# EAGLE board PIRT1280A1-12-carrier (EAGLE 9.6.2)
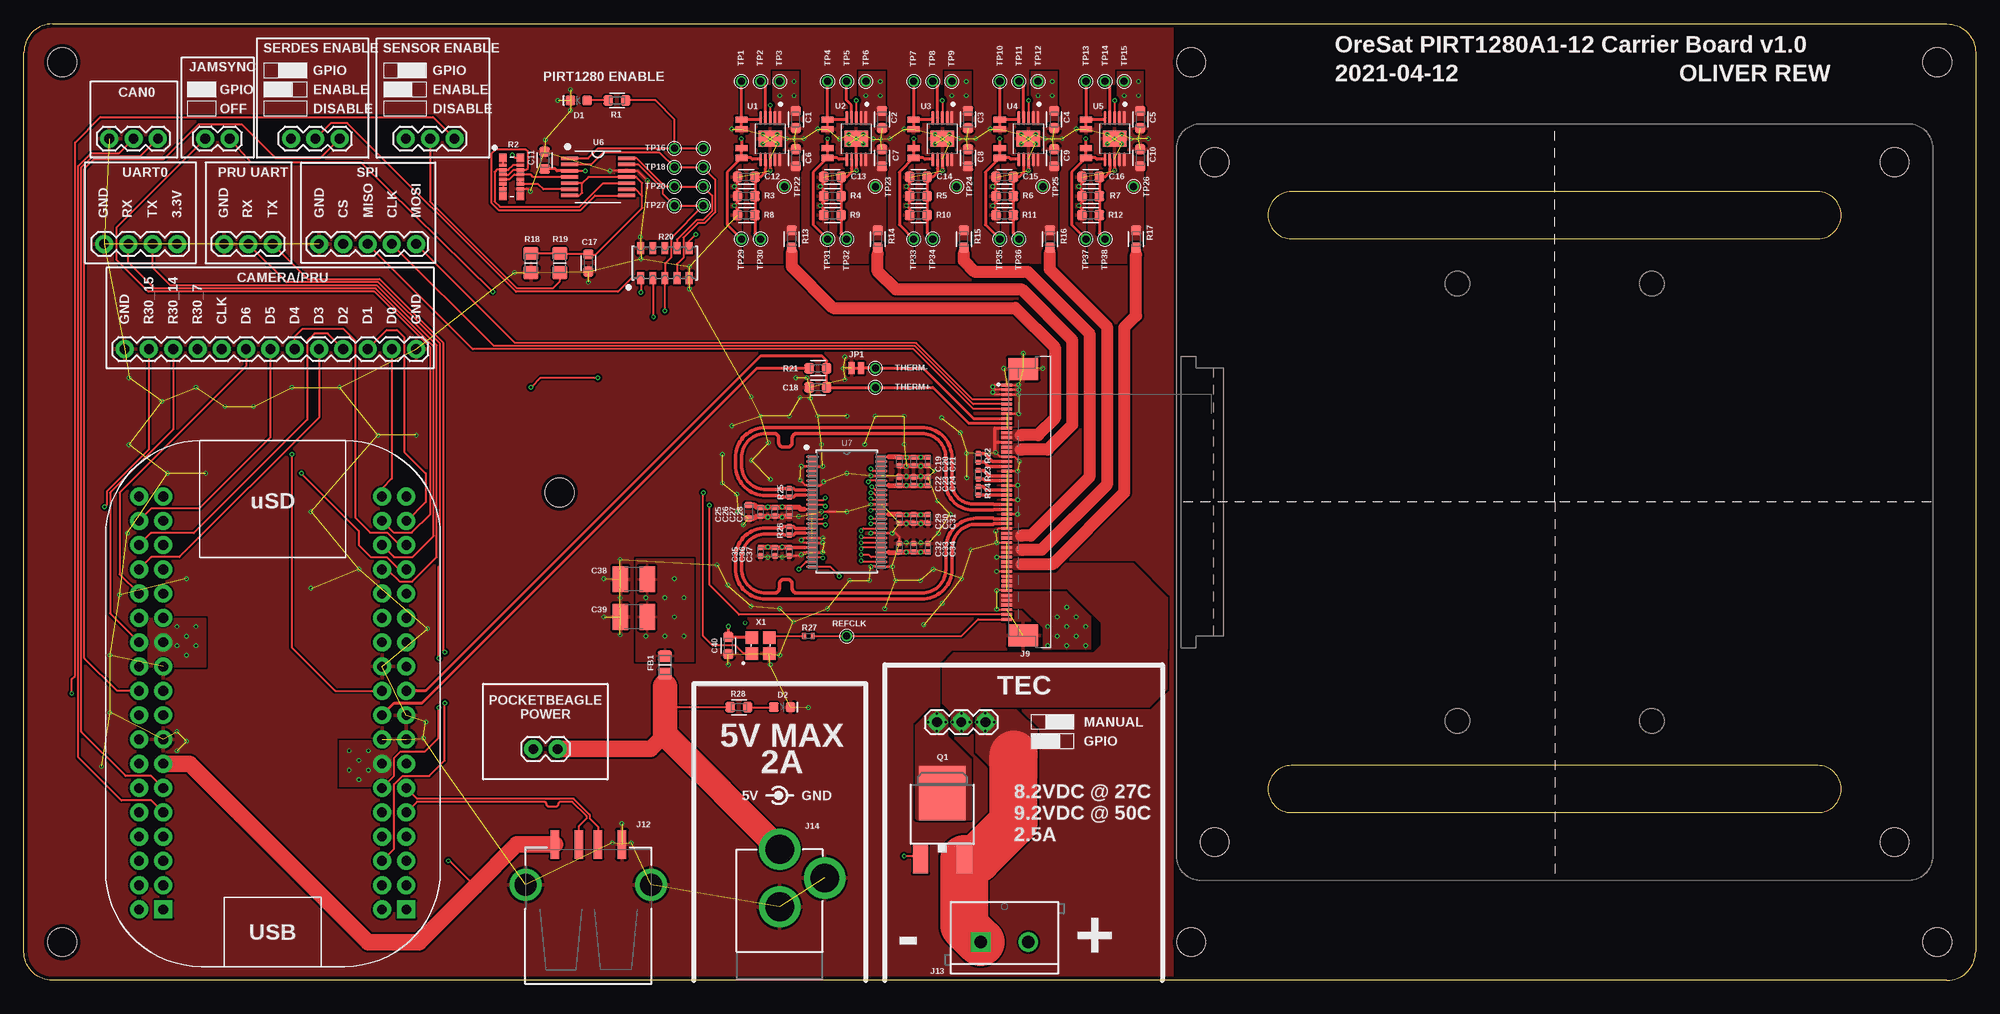
[diagram p7: board, top side]
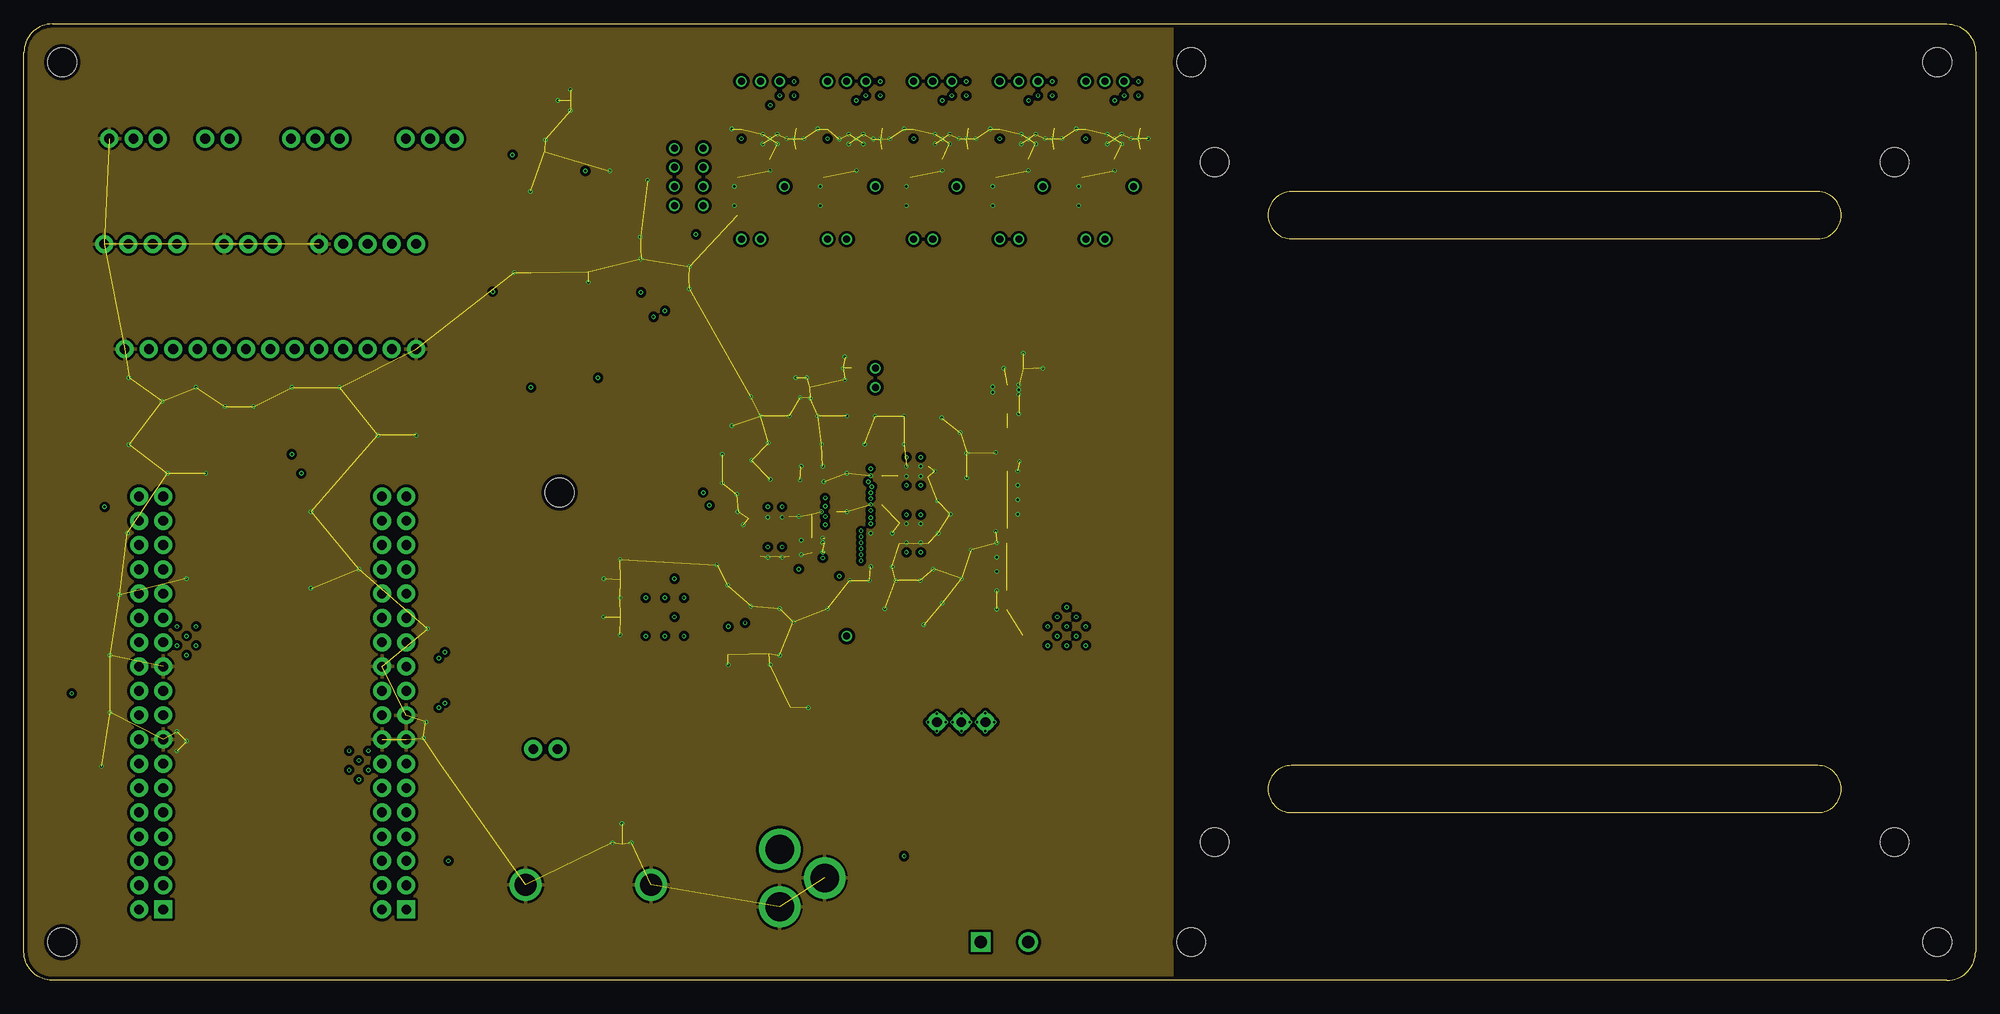
[diagram p8: board, inner layer Route2]
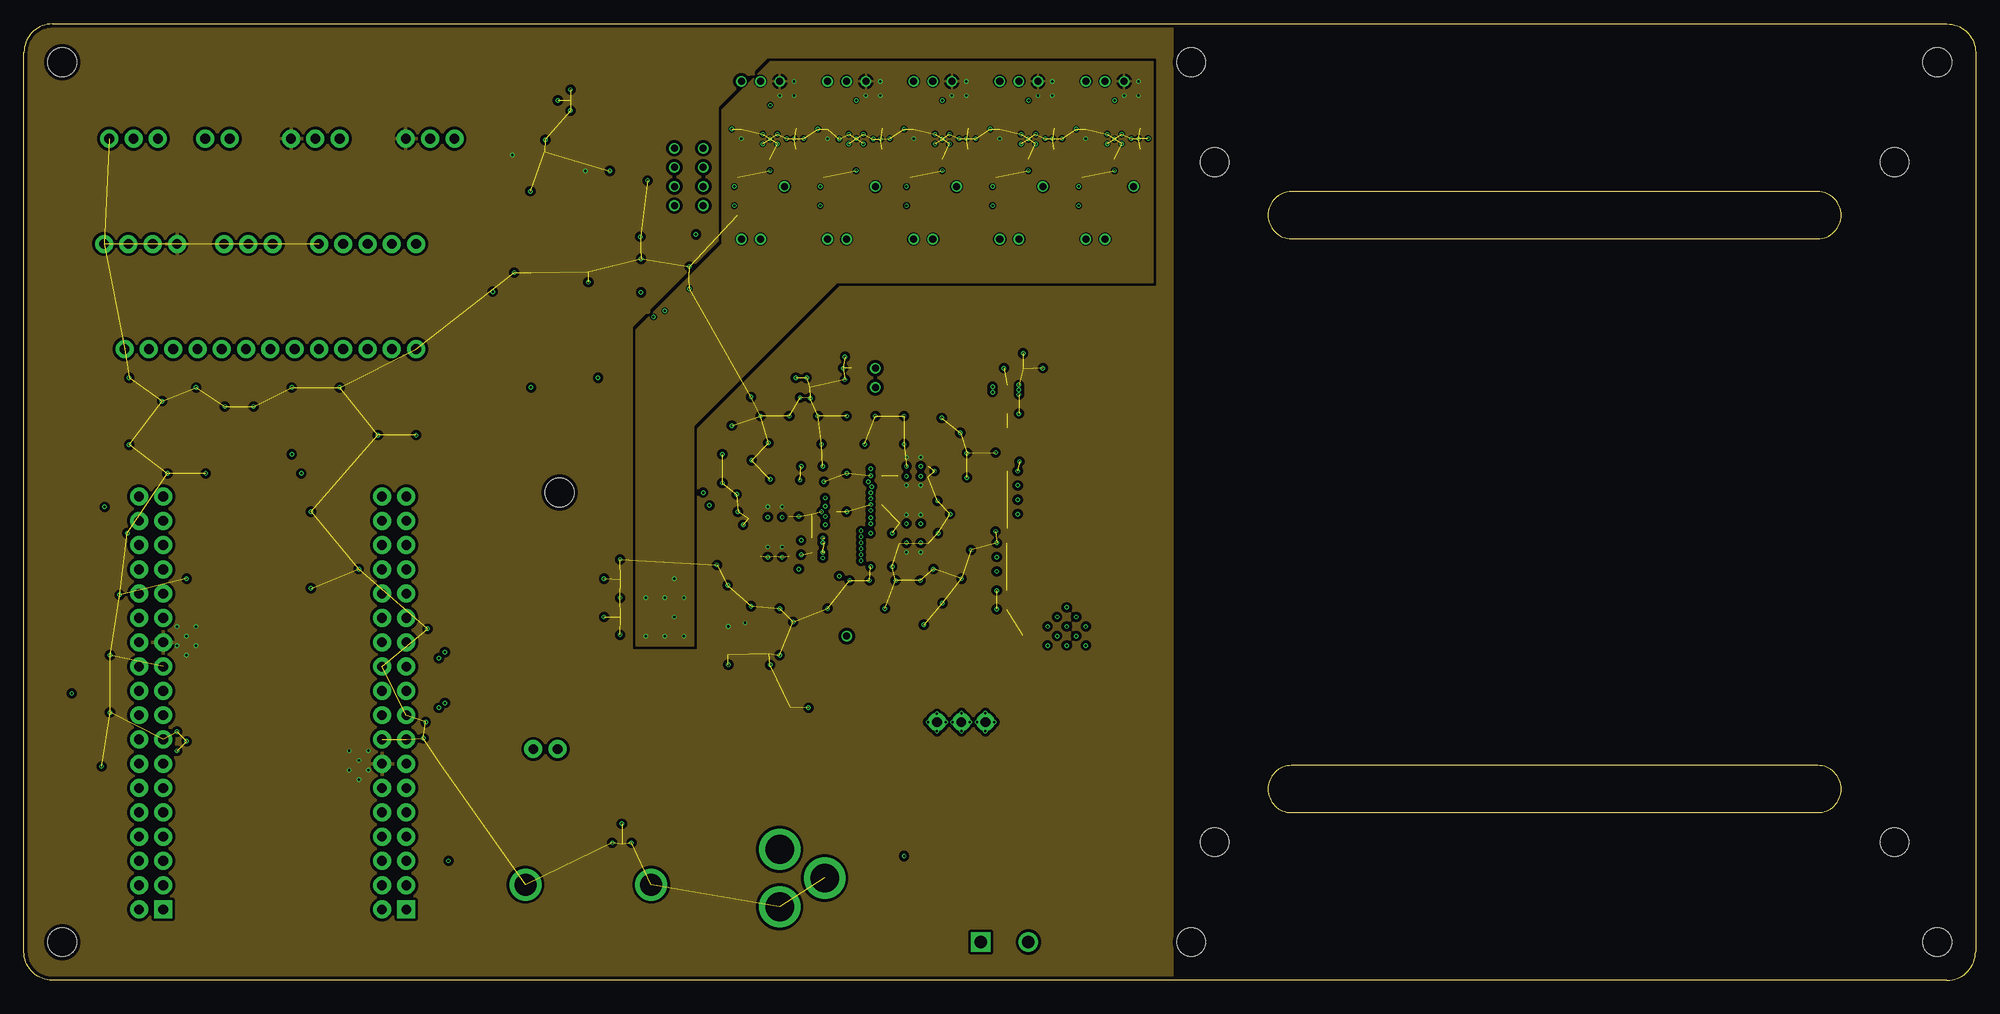
[diagram p9: board, inner layer Route15]
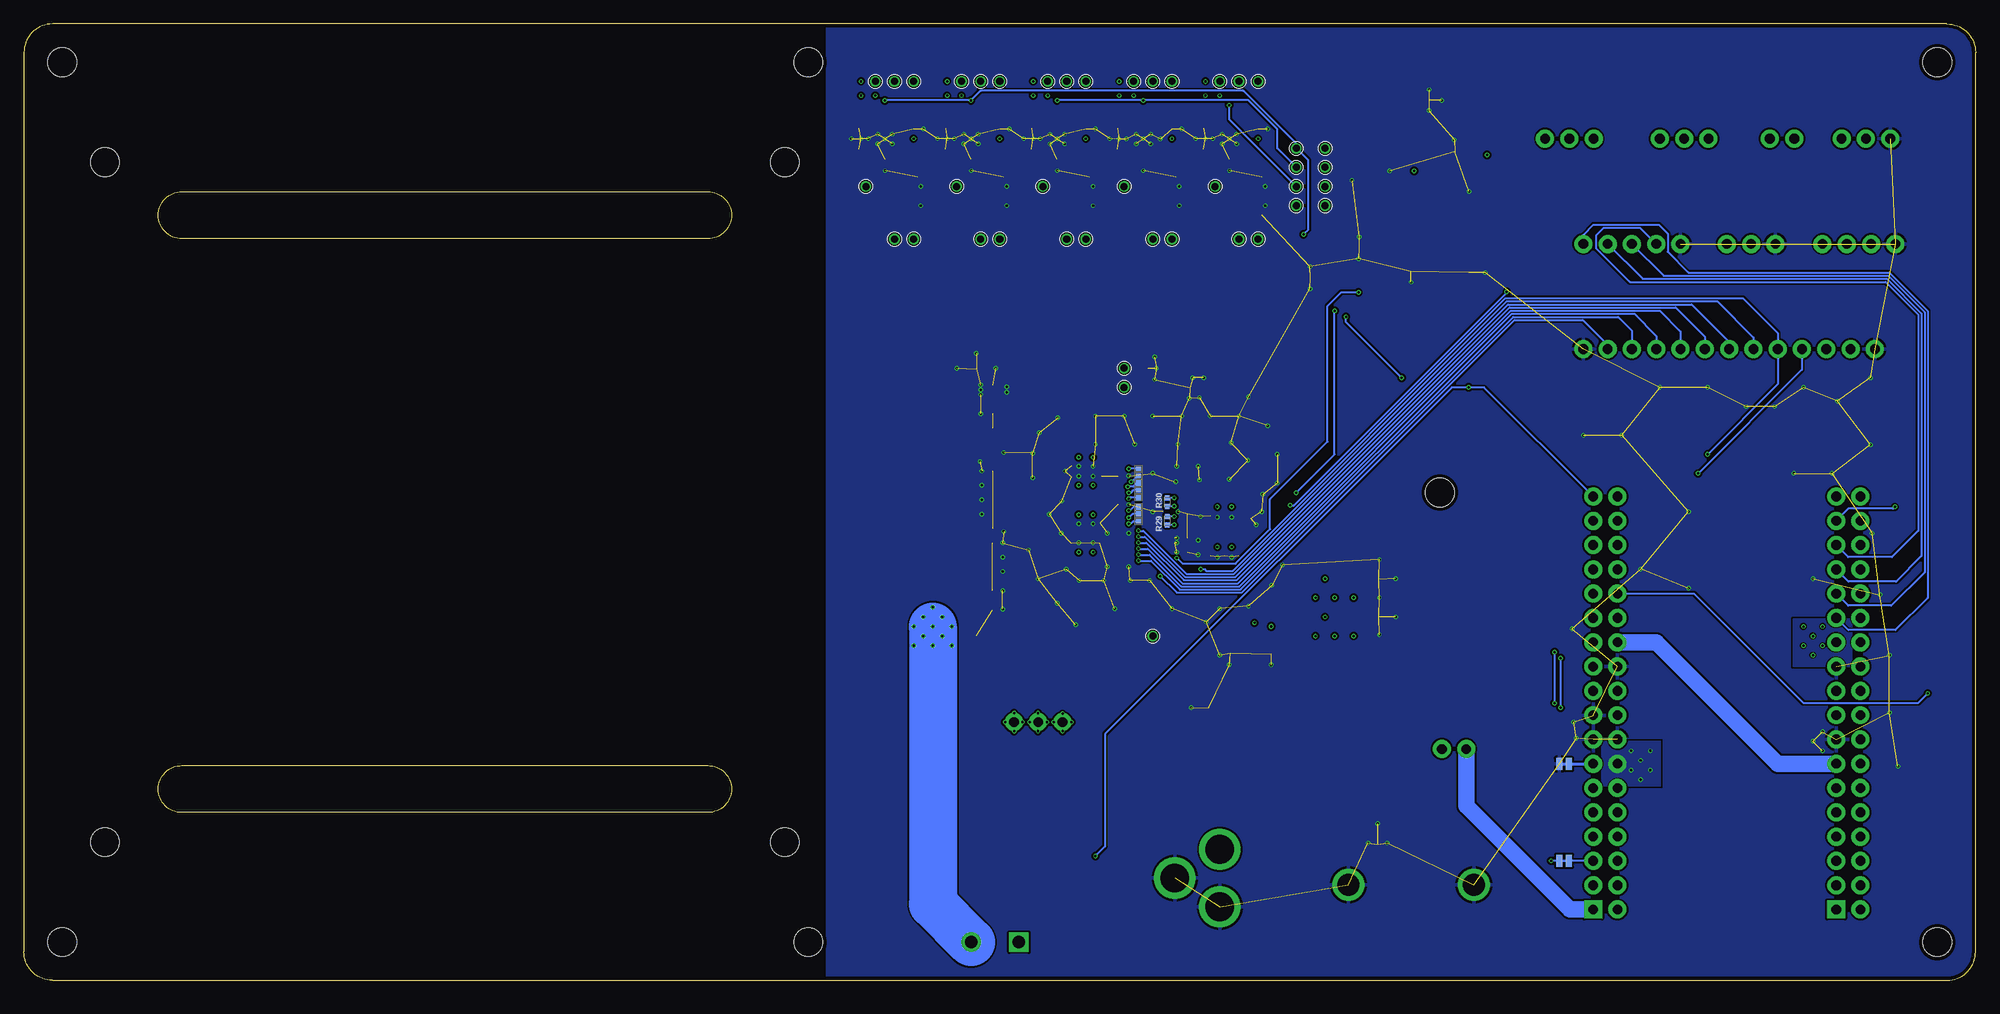
[diagram p10: board, bottom side, seen from below]

Size 204 x 100 mm. Coordinates in mm from the lower left corner, seen from the top.
Outline: 0,3 0,97 arc-90 3,100 201,100 arc-90 204,97 204,3 arc-90 201,0 3,0 arc-90 0,3
Copper layers (1*2*15*16): Top 0.035559375mm / dielectric 0.17018125mm / Route2 0.01778125mm / dielectric 47mil / Route15 0.01778125mm / dielectric 0.17018125mm / Bottom 0.035559375mm
Design rules "oshpark-4layer-tented": minimum track width 5mil, minimum drill 10mil, track to track 5mil, track to pad 5mil, pad to pad 5mil, via to via 5mil, smd to smd 5mil, copper to edge 15mil, drill to drill 6mil, minimum pad ring 4mil, minimum via ring 4mil, stop-mask expansion 2.5mil, vias tented up to drill 20mil, thermal gap 10mil
Net classes: 1 diff-pair: width 0.381 mm, clearance 0.508 mm to class 0, clearance 0.254 mm
Holes 3 mm at 4,4 4,96 200,96 200,4 122,96 122,4 56,51

## Footprints (pad centres in the part's own frame; a part is rotated, then mirrored left to right if it is on the bottom)
.0603-A = smd 1 x 1.05: 1 -0.9,0; 2 0.9,0
.0402-C-NOSILK = smd 0.5 x 0.6: 1 -0.45,0; 2 0.45,0
.0603-C-NOSILK = smd 0.6 x 0.9: 1 -0.7,0; 2 0.7,0
C1210 = smd 1.6 x 2.7: 1 -1.4,0; 2 1.4,0
LED-0603 = smd 1 x 1: A -0.877,0; C 0.877,0
.0805-B = smd 1.15 x 1.45: 1 -0.9,0; 2 0.9,0
1X03 = drill 1.016 pad 1.88: 1 0,0; 2 2.54,0; 3 5.08,0
1X02 = drill 1.016 pad 1.88: 1 0,0; 2 2.54,0
1X04 = drill 1.016 pad 1.88: 1 0,0; 2 2.54,0; 3 5.08,0; 4 7.62,0
1X05 = drill 1.016 pad 1.88: 1 0,0; 2 2.54,0; 3 5.08,0; 4 7.62,0; 5 10.16,0
1X13 = drill 1.016 pad 1.88: 1 0,0; 2 2.54,0; 3 5.08,0; 4 7.62,0; 5 10.16,0; 6 12.7,0; 7 15.24,0; 8 17.78,0; 9 20.32,0; 10 22.86,0; 11 25.4,0; 12 27.94,0; 13 30.48,0
TE_5-1734592-0 = smd 0.3 x 1.1: 1 -12.25,0; 2 -11.75,0; 3 -11.25,0; 4 -10.75,0; 5 -10.25,0; 6 -9.75,0; 7 -9.25,0; 8 -8.75,0; 9 -8.25,0; 10 -7.75,0; 11 -7.25,0; 12 -6.75,0; 13 -6.25,0; 14 -5.75,0; 15 -5.25,0; 16 -4.75,0; 17 -4.25,0; 18 -3.75,0; 19 -3.25,0; 20 -2.75,0; 21 -2.25,0; 22 -1.75,0; 23 -1.25,0; 24 -0.75,0; 25 -0.25,0; 26 0.25,0; 27 0.75,0; 28 1.25,0; 29 1.75,0; 30 2.25,0; 31 2.75,0; 32 3.25,0; 33 3.75,0; 34 4.25,0; 35 4.75,0; 36 5.25,0; 37 5.75,0; 38 6.25,0; 39 6.75,0; 40 7.25,0; 41 7.75,0; 42 8.25,0; 43 8.75,0; 44 9.25,0; 45 9.75,0; 46 10.25,0; 47 10.75,0; 48 11.25,0; 49 11.75,0; 50 12.25,0 | smd 2.3 x 3.1: S1 13.92,1.7; S2 -13.92,1.7
USB-A-S-SILK-FEMALE = smd 3 x 0.9: D+ 7.212,-1; D- 7.212,1; GND 7.212,-3.5; VBUS 7.212,3.5 | drill 2.311: SHLD1 3,-6.566; SHLD2 3,6.566
SCREWTERMINAL-5MM-2 = drill 1.3 pad 2.032 square: 1 0,0 | drill 1.3 pad 2.032: 2 5,0
POWER_JACK = drill 2.997 pad 4.318: GND 0,7.7; GNDBREAK 4.7,10.7; PWR 0,13.7
SMT-JUMPER_2_NC_TRACE_NO-SILK = smd 0.635 x 1.27: 1 -0.508,0; 2 0.508,0
DPAK = smd 1.6 x 3: 1 -2.28,-5.31; 3 2.28,-5.31 | smd 4.826 x 5.715: 4 0,1.588
RES_EXB2HV = smd 0.787 x 0.864: 1 -0.914,1.981; 8 -0.914,-1.981; 9 0.914,-1.981; 16 0.914,1.981 | smd 0.787 x 0.356: 2 -0.914,1.234; 3 -0.914,0.74; 4 -0.914,0.247; 5 -0.914,-0.247; 6 -0.914,-0.74; 7 -0.914,-1.234; 10 0.914,-1.234; 11 0.914,-0.74; 12 0.914,-0.247; 13 0.914,0.247; 14 0.914,0.74; 15 0.914,1.234
.0805-A = smd 1.35 x 1.55: 1 -1,0; 2 1,0
ARRAY_EXBA-M = smd 1.27 x 0.711: 1 -1.575,2.54; 2 -1.575,1.27; 3 -1.575,0; 4 -1.575,-1.27; 5 -1.575,-2.54; 6 1.575,-2.54; 7 1.575,-1.27; 8 1.575,0; 9 1.575,1.27; 10 1.575,2.54
1X01 = drill 0.737 pad 1.1: 1 0,0
TESTPOINT_SMD-0.5MM = smd 0.5 x 0.5: TP 0,0
SOP50P490X110-11N = smd 1.45 x 0.28: 1 -2.16,1; 2 -2.16,0.5; 3 -2.16,0; 4 -2.16,-0.5; 5 -2.16,-1; 6 2.16,-1; 7 2.16,-0.5; 8 2.16,0; 9 2.16,0.5; 10 2.16,1 | smd 1.68 x 2.46: 11 0,0
14-TSSOP = smd 1.778 x 0.356: 1 -2.972,1.95; 2 -2.972,1.3; 3 -2.972,0.65; 4 -2.972,0; 5 -2.972,-0.65; 6 -2.972,-1.3; 7 -2.972,-1.95; 8 2.972,-1.95; 9 2.972,-1.3; 10 2.972,-0.65; 11 2.972,0; 12 2.972,0.65; 13 2.972,1.3; 14 2.972,1.95
MTD48_TEX-L = smd 1.168 x 0.178: 1 -3.619,5.75; 2 -3.619,5.25; 3 -3.619,4.75; 4 -3.619,4.25; 5 -3.619,3.75; 6 -3.619,3.25; 7 -3.619,2.75; 8 -3.619,2.25; 9 -3.619,1.75; 10 -3.619,1.25; 11 -3.619,0.75; 12 -3.619,0.25; 13 -3.619,-0.25; 14 -3.619,-0.75; 15 -3.619,-1.25; 16 -3.619,-1.75; 17 -3.619,-2.25; 18 -3.619,-2.75; 19 -3.619,-3.25; 20 -3.619,-3.75; 21 -3.619,-4.25; 22 -3.619,-4.75; 23 -3.619,-5.25; 24 -3.619,-5.75; 25 3.619,-5.75; 26 3.619,-5.25; 27 3.619,-4.75; 28 3.619,-4.25; 29 3.619,-3.75; 30 3.619,-3.25; 31 3.619,-2.75; 32 3.619,-2.25; 33 3.619,-1.75; 34 3.619,-1.25; 35 3.619,-0.75; 36 3.619,-0.25; 37 3.619,0.25; 38 3.619,0.75; 39 3.619,1.25; 40 3.619,1.75; 41 3.619,2.25; 42 3.619,2.75; 43 3.619,3.25; 44 3.619,3.75; 45 3.619,4.25; 46 3.619,4.75; 47 3.619,5.25; 48 3.619,5.75
PIRT1280_BREAKOUT = hole 3: -35.54,35.54; 35.54,35.54; -35.54,-35.54; 35.54,-35.54
POCKETBEAGLE = drill 1.016 pad 1.88 square: P1_1 13.97,-21.59; P2_1 -11.43,-21.59 | drill 1.016 pad 1.88: P1_2 11.43,-21.59; P1_3 13.97,-19.05; P1_4 11.43,-19.05; P1_5 13.97,-16.51; P1_6 11.43,-16.51; P1_7 13.97,-13.97; P1_8 11.43,-13.97; P1_9 13.97,-11.43; P1_10 11.43,-11.43; P1_11 13.97,-8.89; P1_12 11.43,-8.89; P1_13 13.97,-6.35; P1_14 11.43,-6.35; P1_15 13.97,-3.81; P1_16 11.43,-3.81; P1_17 13.97,-1.27; P1_18 11.43,-1.27; P1_19 13.97,1.27; P1_20 11.43,1.27; P1_21 13.97,3.81; P1_22 11.43,3.81; P1_23 13.97,6.35; P1_24 11.43,6.35; P1_25 13.97,8.89; P1_26 11.43,8.89; P1_27 13.97,11.43; P1_28 11.43,11.43; P1_29 13.97,13.97; P1_30 11.43,13.97; P1_31 13.97,16.51; P1_32 11.43,16.51; P1_33 13.97,19.05; P1_34 11.43,19.05; P1_35 13.97,21.59; P1_36 11.43,21.59; P2_2 -13.97,-21.59; P2_3 -11.43,-19.05; P2_4 -13.97,-19.05; P2_5 -11.43,-16.51; P2_6 -13.97,-16.51; P2_7 -11.43,-13.97; P2_8 -13.97,-13.97; P2_9 -11.43,-11.43; P2_10 -13.97,-11.43; P2_11 -11.43,-8.89; P2_12 -13.97,-8.89; P2_13 -11.43,-6.35; P2_14 -13.97,-6.35; P2_15 -11.43,-3.81; P2_16 -13.97,-3.81; P2_17 -11.43,-1.27; P2_18 -13.97,-1.27; P2_19 -11.43,1.27; P2_20 -13.97,1.27; P2_21 -11.43,3.81; P2_22 -13.97,3.81; P2_23 -11.43,6.35; P2_24 -13.97,6.35; P2_25 -11.43,8.89; P2_26 -13.97,8.89; P2_27 -11.43,11.43; P2_28 -13.97,11.43; P2_29 -11.43,13.97; P2_30 -13.97,13.97; P2_31 -11.43,16.51; P2_32 -13.97,16.51; P2_33 -11.43,19.05; P2_34 -13.97,19.05; P2_35 -11.43,21.59; P2_36 -13.97,21.59
OSC_2.5X2.0 = smd 1.3 x 1.3: 1 -0.9,-0.84; 2 0.9,-0.84; 3 0.9,0.84; 4 -0.9,0.84

## Placement (x,y rotation side)
C1  4.7u  [.0603-A]  80.69,90 270 top
C2  4.7u  [.0603-A]  89.69,90 270 top
C3  4.7u  [.0603-A]  98.69,90 270 top
C4  4.7u  [.0603-A]  107.69,90 270 top
C5  4.7u  [.0603-A]  116.69,90 270 top
C6  4.7u  [.0603-A]  80.69,86 90 top
C7  4.7u  [.0603-A]  89.69,86 90 top
C8  4.7u  [.0603-A]  98.69,86 90 top
C9  4.7u  [.0603-A]  107.69,86 90 top
C10  4.7u  [.0603-A]  116.69,86 90 top
C11  0.1u  [.0603-A]  54.44,85.75 90 top
C12  0.47u  [.0603-A]  75.5,84 180 top
C13  0.47u  [.0603-A]  84.5,84 180 top
C14  0.47u  [.0603-A]  93.5,84 180 top
C15  0.47u  [.0603-A]  102.5,84 180 top
C16  0.47u  [.0603-A]  111.5,84 180 top
C17  1u  [.0603-A]  59,75 270 top
C18  0.1u  [.0603-A]  83,62 180 top
C19  1n  [.0402-C-NOSILK]  91.5,54.25 270 top
C20  10n  [.0402-C-NOSILK]  93,54.25 270 top
C21  100n  [.0402-C-NOSILK]  94.5,54.25 270 top
C22  1n  [.0402-C-NOSILK]  91.5,52.19 90 top
C23  10n  [.0402-C-NOSILK]  93,52.19 90 top
C24  100n  [.0402-C-NOSILK]  94.5,52.19 90 top
C25  10u  [.0603-C-NOSILK]  75.75,49 270 top
C26  100n  [.0402-C-NOSILK]  77,49 270 top
C27  10n  [.0402-C-NOSILK]  78.5,49 270 top
C28  1n  [.0402-C-NOSILK]  80,49 270 top
C29  1n  [.0402-C-NOSILK]  91.5,48.25 270 top
C30  10n  [.0402-C-NOSILK]  93,48.25 270 top
C31  100n  [.0402-C-NOSILK]  94.5,48.25 270 top
C32  1n  [.0402-C-NOSILK]  91.5,45.25 90 top
C33  10n  [.0402-C-NOSILK]  93,45.25 90 top
C34  100n  [.0402-C-NOSILK]  94.5,45.25 90 top
C35  100n  [.0402-C-NOSILK]  77,44.81 270 top
C36  10n  [.0402-C-NOSILK]  78.5,44.81 270 top
C37  1n  [.0402-C-NOSILK]  80,44.81 270 top
C38  NP  [C1210]  63.75,41.94 180 top
C39  NP  [C1210]  63.75,38 180 top
C40  0.1u  [.0603-A]  73.62,35 270 top
D1  GREEN  [LED-0603]  58,92 180 top
D2  GREEN  [LED-0603]  79.25,28.56 0 top
FB1  [.0805-B]  67,33 90 top
J1  455-1750-1-ND  [1X03]  14,88 180 top
J2  [1X02]  21.5,88 180 top
J3  455-1750-1-ND  [1X03]  33,88 180 top
J4  455-1750-1-ND  [1X03]  45,88 180 top
J5  [1X04]  16,77 180 top
J6  455-1750-1-ND  [1X03]  26,77 180 top
J7  [1X05]  41,77 180 top
J8  [1X13]  41,66 180 top
J9  5-1734592-0  [TE_5-1734592-0]  102.75,50 270 top
J10  455-1750-1-ND  [1X03]  95.44,27 0 top
J11  [1X02]  53.25,24.19 0 top
J12  USB_A_SMT_FEMALE  [USB-A-S-SILK-FEMALE]  59,7 90 top
J13  [SCREWTERMINAL-5MM-2]  100,4 0 top
J14  POWER_JACK  [POWER_JACK]  79,0 0 top
JP1  JUMPER-SMT_2_NC_TRACE_NO-SILK  [SMT-JUMPER_2_NC_TRACE_NO-SILK]  87,64 0 top
JP2  JUMPER-SMT_2_NC_TRACE_NO-SILK  [SMT-JUMPER_2_NC_TRACE_NO-SILK]  43,12.5 180 bottom
JP3  JUMPER-SMT_2_NC_TRACE_NO-SILK  [SMT-JUMPER_2_NC_TRACE_NO-SILK]  43,22.62 180 bottom
Q1  35A/25V/8.5mΩ  [DPAK]  96,18 0 top
R1  1k  [.0603-A]  62,92 0 top
R2  10k  [RES_EXB2HV]  51,84 0 top
R3  29.4k  [.0603-A]  75.5,82 0 top
R4  9.09k  [.0603-A]  84.5,82 0 top
R5  16.2k  [.0603-A]  93.5,82 0 top
R6  33.2k  [.0603-A]  102.5,82 0 top
R7  33.2k  [.0603-A]  111.5,82 0 top
R8  NP  [.0603-A]  75.5,80 0 top
R9  NP  [.0603-A]  84.5,80 0 top
R10  NP  [.0603-A]  93.5,80 0 top
R11  NP  [.0603-A]  102.5,80 0 top
R12  NP  [.0603-A]  111.5,80 0 top
R13  0  [.0603-A]  80.25,77.5 90 top
R14  0  [.0603-A]  89.25,77.5 90 top
R15  0  [.0603-A]  98.25,77.5 90 top
R16  0  [.0603-A]  107.25,77.5 90 top
R17  0  [.0603-A]  116.25,77.5 90 top
R18  200k  [.0805-A]  53,75 90 top
R19  20k  [.0805-A]  56,75 90 top
R20  10k  [ARRAY_EXBA-M]  67,75 90 top
R21  10k  [.0603-A]  83,64 180 top
R22  NP  [.0402-C-NOSILK]  99.75,54.62 90 top
R23  NP  [.0402-C-NOSILK]  99.75,52.88 90 top
R24  NP  [.0402-C-NOSILK]  99.75,51.19 90 top
R25  100  [.0402-C-NOSILK]  80,51 90 top
R26  100  [.0402-C-NOSILK]  80,47 270 top
R27  100  [.0402-C-NOSILK]  82,36 0 top
R28  1k  [.0603-A]  74.75,28.56 180 top
R29  NP  [.0402-C-NOSILK]  84.5,48.05 90 bottom
R30  NP  [.0402-C-NOSILK]  84.5,50 90 bottom
REFCLK  TEST-POINT-LARGE-SQUARE  [1X01]  86,36 0 top
SJ1  JUMPER-SMT_2_NC_TRACE_NO-SILK  [SMT-JUMPER_2_NC_TRACE_NO-SILK]  75,89.5 90 top
SJ2  JUMPER-SMT_2_NC_TRACE_NO-SILK  [SMT-JUMPER_2_NC_TRACE_NO-SILK]  84,89.5 90 top
SJ3  JUMPER-SMT_2_NC_TRACE_NO-SILK  [SMT-JUMPER_2_NC_TRACE_NO-SILK]  93,89.5 90 top
SJ4  JUMPER-SMT_2_NC_TRACE_NO-SILK  [SMT-JUMPER_2_NC_TRACE_NO-SILK]  102,89.5 90 top
SJ5  JUMPER-SMT_2_NC_TRACE_NO-SILK  [SMT-JUMPER_2_NC_TRACE_NO-SILK]  111,89.5 90 top
SJ6  JUMPER-SMT_2_NC_TRACE_NO-SILK  [SMT-JUMPER_2_NC_TRACE_NO-SILK]  75,86.5 90 top
SJ7  JUMPER-SMT_2_NC_TRACE_NO-SILK  [SMT-JUMPER_2_NC_TRACE_NO-SILK]  84,86.5 90 top
SJ8  JUMPER-SMT_2_NC_TRACE_NO-SILK  [SMT-JUMPER_2_NC_TRACE_NO-SILK]  93,86.5 90 top
SJ9  JUMPER-SMT_2_NC_TRACE_NO-SILK  [SMT-JUMPER_2_NC_TRACE_NO-SILK]  102,86.5 90 top
SJ10  JUMPER-SMT_2_NC_TRACE_NO-SILK  [SMT-JUMPER_2_NC_TRACE_NO-SILK]  111,86.5 90 top
THERM+  TEST-POINT-LARGE-SQUARE  [1X01]  89,62 0 top
THERM-  TEST-POINT-LARGE-SQUARE  [1X01]  89,64 0 top
TP1  TEST-POINT-LARGE-SQUARE  [1X01]  75,94 270 top
TP2  TEST-POINT-LARGE-SQUARE  [1X01]  77,94 270 top
TP3  TEST-POINT-LARGE-SQUARE  [1X01]  79,94 270 top
TP4  TEST-POINT-LARGE-SQUARE  [1X01]  84,94 90 top
TP5  TEST-POINT-LARGE-SQUARE  [1X01]  86,94 90 top
TP6  TEST-POINT-LARGE-SQUARE  [1X01]  88,94 90 top
TP7  TEST-POINT-LARGE-SQUARE  [1X01]  93,94 270 top
TP8  TEST-POINT-LARGE-SQUARE  [1X01]  95,94 270 top
TP9  TEST-POINT-LARGE-SQUARE  [1X01]  97,94 270 top
TP10  TEST-POINT-LARGE-SQUARE  [1X01]  102,94 270 top
TP11  TEST-POINT-LARGE-SQUARE  [1X01]  104,94 270 top
TP12  TEST-POINT-LARGE-SQUARE  [1X01]  106,94 270 top
TP13  TEST-POINT-LARGE-SQUARE  [1X01]  111,94 270 top
TP14  TEST-POINT-LARGE-SQUARE  [1X01]  113,94 270 top
TP15  TEST-POINT-LARGE-SQUARE  [1X01]  115,94 270 top
TP16  TEST-POINT-LARGE-SQUARE  [1X01]  68,87 0 top
TP17  TEST-POINT-LARGE-SQUARE  [1X01]  71,87 0 top
TP18  TEST-POINT-LARGE-SQUARE  [1X01]  68,85 0 top
TP19  TEST-POINT-LARGE-SQUARE  [1X01]  71,85 0 top
TP20  TEST-POINT-LARGE-SQUARE  [1X01]  68,83 0 top
TP21  TEST-POINT-LARGE-SQUARE  [1X01]  71,83 0 top
TP22  TEST-POINT-LARGE-SQUARE  [1X01]  79.5,83 270 top
TP23  TEST-POINT-LARGE-SQUARE  [1X01]  89,83 270 top
TP24  TEST-POINT-LARGE-SQUARE  [1X01]  97.5,83 270 top
TP25  TEST-POINT-LARGE-SQUARE  [1X01]  106.5,83 270 top
TP26  TEST-POINT-LARGE-SQUARE  [1X01]  116,83 270 top
TP27  TEST-POINT-LARGE-SQUARE  [1X01]  68,81 0 top
TP28  TEST-POINT-LARGE-SQUARE  [1X01]  71,81 0 top
TP29  TEST-POINT-LARGE-SQUARE  [1X01]  75,77.5 270 top
TP30  TEST-POINT-LARGE-SQUARE  [1X01]  77,77.5 270 top
TP31  TEST-POINT-LARGE-SQUARE  [1X01]  84,77.5 270 top
TP32  TEST-POINT-LARGE-SQUARE  [1X01]  86,77.5 90 top
TP33  TEST-POINT-LARGE-SQUARE  [1X01]  93,77.5 270 top
TP34  TEST-POINT-LARGE-SQUARE  [1X01]  95,77.5 270 top
TP35  TEST-POINT-LARGE-SQUARE  [1X01]  102,77.5 270 top
TP36  TEST-POINT-LARGE-SQUARE  [1X01]  104,77.5 270 top
TP37  TEST-POINT-LARGE-SQUARE  [1X01]  111,77.5 270 top
TP38  TEST-POINT-LARGE-SQUARE  [1X01]  113,77.5 270 top
TP39  TEST-POINT-SMD-0.5MM  [TESTPOINT_SMD-0.5MM]  87.5,48 180 bottom
TP40  TEST-POINT-SMD-0.5MM  [TESTPOINT_SMD-0.5MM]  87.5,48.75 180 bottom
TP41  TEST-POINT-SMD-0.5MM  [TESTPOINT_SMD-0.5MM]  87.5,49.5 180 bottom
TP42  TEST-POINT-SMD-0.5MM  [TESTPOINT_SMD-0.5MM]  87.5,50.5 180 bottom
TP43  TEST-POINT-SMD-0.5MM  [TESTPOINT_SMD-0.5MM]  87.5,51.25 180 bottom
TP44  TEST-POINT-SMD-0.5MM  [TESTPOINT_SMD-0.5MM]  87.5,52 180 bottom
TP45  TEST-POINT-SMD-0.5MM  [TESTPOINT_SMD-0.5MM]  87.5,52.75 180 bottom
TP46  TEST-POINT-SMD-0.5MM  [TESTPOINT_SMD-0.5MM]  87.5,53.5 180 bottom
U1  LT3042IMSE#TRPBF  [SOP50P490X110-11N]  78,88 270 top
U2  LT3042IMSE#TRPBF  [SOP50P490X110-11N]  87,88 270 top
U3  LT3042IMSE#TRPBF  [SOP50P490X110-11N]  96,88 270 top
U4  LT3042IMSE#TRPBF  [SOP50P490X110-11N]  105,88 270 top
U5  LT3042IMSE#TRPBF  [SOP50P490X110-11N]  114,88 270 top
U6  TLC3704IPWRPW14-M  [14-TSSOP]  60,84 0 top
U7  DS90CR218AMTD/NOPBMTD48_TEX-L  [MTD48_TEX-L]  86,49 0 top
U$1  [PIRT1280_BREAKOUT]  160,50 0 top
U$2  POCKETBEAGLE  [POCKETBEAGLE]  26,29 0 top
U$3  [POLARITY_SYMBOL_SMALL]  78.87,19.33 0 top
X1  16MHz  [OSC_2.5X2.0]  77,35 0 top

## Tracks (layer width: path | path; a pad name or v marks a point on that pad's centre or on a via)
1.8V-A
  Top 0.305: U$2.P1_18 38.7,29 41.62,29 76.62,64 R21.2
3.3V  (via drill 0.25, 0.3)
  Top 0.2: U6.3 58.66,84.65 v58.69,84.62 | R2.16 51.39,85.98 v51.06,86.31 | U7.28 90.38,44.75 | U7.36 90.38,48.75 | U7.42 90.38,51.75 | U7.48 90.38,54.75 | U7.12 81.56,49.25 | U7.20 81.62,45.25
  Top 0.305: U6.3 55.73,84.65 55.52,84.85 C11.1 | v73.62,37 C40.1 73.69,35.84 X1.4
  Top 0.381: C37.1 81.61,45.26 81.62,45.25
  Top 0.508: C24.1 94.49,51.75 v93.75,51.75 93.01,51.75 C23.1 92.99,51.75 v92.25,51.75 91.51,51.75 C22.1 91.49,51.75 90.38,51.75 | C31.1 93.76,48.7 v93.75,48.69 93.74,48.7 C30.1 92.26,48.7 v92.25,48.69 92.24,48.7 C29.1 91.45,48.75 90.38,48.75 | C21.1 93.76,54.7 v93.75,54.69 93.74,54.7 C20.1 92.26,54.7 v92.25,54.69 92.24,54.7 C19.1 91.45,54.75 90.38,54.75 | 92.2,44.8 C32.1 91.45,44.75 90.38,44.75 | 92.2,44.8 v92.25,44.75 | 92.2,44.8 C33.1 93.7,44.8 | 93.7,44.8 v93.75,44.75 | C34.1 93.7,44.8 | 81.05,49.45 81,49.45 | 81,49.45 C28.1 79.3,49.45 v79.25,49.5 79.2,49.45 C27.1 77.8,49.45 | 77.8,49.45 v77.75,49.5 | 77.8,49.45 C26.1 76.61,49.45 76.36,49.7 C25.1 | 80.01,45.25 C37.1 79.3,45.26 | 79.3,45.26 v79.25,45.31 | 79.3,45.26 C36.1 77.8,45.26 v77.75,45.31 77.7,45.26 C35.1 | 81,49.45 81.2,49.25 81.56,49.25
  other vias: 75.38,37.38 36,24 34,24 35,23 36,22 34,22 35,21 16,37 18,37 17,36 18,35 16,35 17,34
  pour Route15 (isolate 0.3, rank 2): -2.99,103 -3.01,-3 120,-3 120,103
  pour Bottom (no thermals): 39,25 33,25 33,20.31 39,20.31
  pour Top (no thermals): 19,37.81 13,37.81 13,32.81 19,32.81
  pour Top (no thermals): 39,25 33,25 33,20.31 39,20.31
3.3V3
  pour Bottom (no thermals): 19,37.81 13,37.81 13,32.81 19,32.81
5V  (via drill 0.25)
  Top 0.305: v93,88 SJ8.2 | v75,88 SJ6.2 | SJ7.2 v84,88 | SJ9.2 v102,88 | SJ10.2 v111,88
  other vias: 88,92.5 89.5,92.5 89.5,94 115,92.5 116.5,92.5 116.5,94 97,92.5 98.5,92.5 98.5,94 106,92.5 107.5,92.5 107.5,94 79,92.5 80.5,92.5 80.5,94 69,36 67,36 65,36 68,38 69,40 67,40 65,40 68,42
  pour Top (isolate 0.254, no thermals): 87.25,89.49 90.04,89.49 90.04,95 87.25,95
  pour Top (isolate 0.254, no thermals): 114.25,89.49 117.04,89.49 117.04,95 114.25,95
  pour Top (isolate 0.254, no thermals): 96.25,89.49 99.04,89.49 99.04,95 96.25,95
  pour Top (isolate 0.254, no thermals): 105.25,89.49 108.04,89.49 108.04,95 105.25,95
  pour Top (isolate 0.254, no thermals): 78.25,89.49 81.04,89.49 81.04,95 78.25,95
  pour Top: 70,33.38 70,44 64,44 64,33.38
  pour Route15: 70,35 70,58 85,73 118,73 118,96 78,96 73,91 73,77 64,68 64,35
!PWR_DWN  (via drill 0.25)
  Top 0.2: J3.2 32.09,89.62 33.81,89.62 51.44,72 62.1,72 63.52,73.42 R20.1 64.5,73.39 v64.5,71.94 | U7.22 83.42,44.25 v83.5,44.17
  Bottom 0.2: v83.5,44.17 82.9,43.56 77.36,43.56 73.75,47.17 73.75,50.31 67.75,56.31 67.75,70.5 66.31,71.94 v64.5,71.94
CAN_RX
  Top 0.2: U$2.P2_9 13.33,18.81 10.19,18.81 5.67,23.33 5.67,85.14 7.04,86.5 9.96,86.5 J1.2
CAN_TX
  Top 0.2: U$2.P2_11 13.3,21.38 10.62,21.38 6,26 6,85 7.17,86.17 12.17,86.17 J1.1
GND  (via drill 0.25, 0.3)  (252 unrouted)
  Top 0.2: v81.12,52.31 81.69,51.75 U7.7 83.25,51.75 v83.62,52.12 | v61.25,84.62 61.27,84.65 U6.12 64.16,84.65 v65.19,83.62 | R2.10 52.67,82.77 v52.94,82.5 | J9.31 101.88,47.25 v101.56,46.94 | J9.28 v103.88,48.75 | v101.56,55.19 102,54.75 J9.16 103.56,54.75 v104.06,54.25 | J9.19 v103.88,53.25 | J9.22 v103.88,51.75 | J9.25 v103.88,50.25 | J9.34 v101.69,45.75 | J9.37 v101.69,44.25 | J9.40 v101.69,42.75 | J9.48 101.75,38.75 v101.69,38.81 | J9.44 v101.69,40.75 | J9.7 v104,59.25 | v104,61.25 J9.3 101.5,61.25 v101.25,61.5 101.5,61.75 J9.2 | J9.2 v104,61.75 | v104,62.25 J9.1 101.44,62.25 v101.25,62.06 101.56,61.75 J9.2 | v90.75,43.25 U7.25 v88.5,43.25 | C32.2 91.5,46.38 91.12,46.75 v90.75,46.75 U7.32 v88.5,46.75 | U7.38 v88.5,49.75 | U7.44 v88.5,52.75 | U7.19 81.5,45.75 v81.25,46 81.5,46.25 U7.18
  Top 0.203: C37.2 81.11,44.36 81.5,44.75 U7.21 83.69,44.75 | 83.69,45.75 U7.19 U7.18 83.69,46.25 | v83.38,49 84.94,49 | v81.25,53.75 U7.3 v83.5,53.75
  Top 0.254: U2.11 U2.8
  Top 0.305: U2.8 v87,84.67 v86.99,84.66 | U5.8 v114,84.67 v113.99,84.66 | U3.8 v96,84.67 v95.99,84.66 | R10.1 92.6,80.65 v92.25,81 92.6,81.35 R5.1 92.6,82.65 v92.25,83 92.6,83.35 C14.2 | C12.2 74.6,83.35 v74.25,83 74.6,82.65 R3.1 74.6,81.35 v74.25,81 74.6,80.65 R8.1 | R9.1 83.6,80.65 v83.25,81 83.6,81.35 R4.1 83.6,82.65 v83.25,83 83.6,83.35 C13.2 | C15.2 101.6,83.35 v101.25,83 101.6,82.65 R6.1 101.6,81.35 v101.25,81 101.6,80.65 R11.1 | C16.2 110.6,83.35 v110.25,83 110.6,82.65 R7.1 110.6,81.35 v110.25,81 110.6,80.65 R12.1 | U1.8 v77.99,84.66 | U4.8 v105,84.67 v104.99,84.66 | J9.13 101.5,56.25 | 101.5,56.25 101.5,57.75 J9.10 | v101.56,55.19 101.5,55.25 101.5,56.25
  Top 0.508: 91.39,52.75 C22.2 91.55,52.69 v92.25,52.69 92.95,52.69 C23.2 93.05,52.69 v93.75,52.69 94.45,52.69 C24.2 | C19.2 92.2,53.8 | 92.2,53.8 v92.25,53.75 | 92.2,53.8 C20.2 93.7,53.8 | v93.75,53.75 93.7,53.8 | C21.2 93.7,53.8 | C29.2 92.2,47.8 | 92.2,47.8 v92.25,47.75 | 92.2,47.8 C30.2 93.7,47.8 | 93.7,47.8 v93.75,47.75 | C31.2 93.7,47.8 | C25.2 76.3,48.3 76.55,48.55 C26.2 77.64,48.55 v77.75,48.44 77.86,48.55 C27.2 79.14,48.55 v79.25,48.44 79.36,48.55 C28.2
  other vias: 87.75,88.47 87.75,87.46 87,88 86.23,88.47 86.23,87.46 85.21,87.96 89.53,87.96 88.77,87.96 79.25,44.25 77.75,44.25 93.75,45.75 92.25,45.75 115.75,88 116.5,88 96.75,88.47 96.75,87.46 95.99,87.96 95.23,88.47 95.23,87.46 78.75,88.47 78.75,87.46 77.99,87.96 77.23,88.47 77.23,87.46 105.75,88.47 105.75,87.46 104.99,87.96 104.23,88.47 104.23,87.46 114.75,88.47 114.75,87.46 113.99,87.96 113.23,88.47 113.23,87.46 108.5,88 117.5,88 90.5,88 99.5,88 81.5,88 74,89 92,89 110,89 83,89 83.5,44.75 83.5,45.75 83.5,46.25 81.25,44.5 81,48.5 82.19,60.88 81.12,60.94 81.81,63 80.69,63 76,61 85.62,64 85.81,65.19 85.81,62.81 57.12,93.12 55.81,92 57.12,90.94 69.56,72.31 64.44,77.75 64.5,75.44 69.56,74.62 104.44,65.56 102.44,64 106.5,64 30,41 30,49 35,43 19,53 15,53 21,60 24,60 28,62 33,62 37,57 41,57 18,62 14.44,60.56 11,63 11,56 17,42 9,34 9,28 8.12,22.38 42.19,36.75 94.06,37.19 80.41,37.47 99,45 98,42 96,39.44 90,38.88 84,38.88 79,38.88 73.56,41.31 75.19,47.62 74.62,49 86,49 86,53 78,52.38 76.06,54.38 77.81,56.19 83.38,56.06 87.88,56.06 92,56.06 95.19,53.25 96.81,48.75 95.5,50.12 95.56,46.75 95.06,43 93.69,41.81 91.12,41.81 88.38,41.81 86.31,41.81 98.56,52.56 98.56,55.12 97.88,57.25 95.94,58.81 92,59 89,59 86,59 83,59 80,59 77,59 74,58 73,55 73,52 74.5,50.81 78,33 79,34 62.5,16.38 63.5,14.38 61.5,14.38 42,27 41.75,25.31 17,25 16,26 16,24 10,40.31 10.81,46.75 101,89 106.75,88 107.5,88 97.75,88 98.5,88 79.75,88 80.5,88 54.5,87.88 73.62,33 72.44,43.44 76,39.12 82,28.5 60.62,42 62.31,44 62.31,40 60.62,38 62.31,36.12 59,73 51.25,74
  pour Top (isolate 0.2, rank 2): -1,101 -1,-1 120,-1 120,101
  pour Top (no thermals): 84,49 79.62,49 79.56,48.94 79.56,48.25 79.69,48.12 81.5,48.12 81.81,48.44 84,48.44
  pour Bottom (isolate 0.2, rank 2): -2,102 -2,-2 120,-2 120,102
  pour Route2 (isolate 0.3, rank 2): -4,104 -4,-4 120,-4 120,104
JAMSYNC  (via drill 0.25)
  Top 0.2: J9.49 74.75,38.25 71.66,41.34 v71.66,49.66 | J2.1 23.75,85.5 35.25,85.5 v49,72
  Bottom 0.2: v71.66,49.66 71.27,49.66 49,71.92 v49,72
N$1
  Top 0.2: R2.2 R2.1
N$2
  Top 0.2: R2.15 51.11,85.23 50.62,84.74 R2.3 49.43,84.74 49.19,84.5 49.19,81.44 49.75,80.88 58.06,80.88 60.54,83.35 U6.10
N$3
  Top 0.2: R2.4 50.68,84.25 51.18,84.74 R2.14 52.49,84.74 52.69,84.94 52.69,86.62 52.44,86.88 49.31,86.88 48.86,86.42 48.86,81.3 49.62,80.55 58.2,80.55 59.7,82.05 U6.8
N$4
  Top 0.2: R2.5 50.75,83.75 51.25,84.25 R2.13 53,84.25 53.25,84 U6.4
N$5
  Top 0.2: 64.62,82 64.62,80.75 59.77,75.9 C17.1 58.9,76 R19.2 R18.2 | 64.62,82 63.92,82.7 U6.9 | 64.62,82 64.62,83.38 64,84 U6.11 59,84 58.35,83.35 | 58.35,83.35 U6.5 | U6.7 58.05,82.05 58.35,82.35 58.35,83.35
N$6
  Top 0.2: R2.6 R2.7
N$7
  Top 0.2: FB1.1 67,29 67.44,28.56 R28.2
  Top 1.75: J11.2 65.49,24.19 67,25.7
  Top 2.54: J14.PWR 67,25.7 67,29 67,30.75
N$8
  Bottom 0.2: U$2.P1_5 JP2.1
N$9
  Top 0.2: X1.3 78.06,36 R27.1
N$10  (via drill 0.25)
  Top 0.2: U6.14 64.05,85.95 67,83 TP20.1 TP21.1 71.94,82.06 71.94,80.44 71,79.5 70.31,79.5 68.27,77.46 R20.7 | v78.01,91.5 v78,91.49 U1.3
  Bottom 0.2: TP21.1 78.01,90.01 v78.01,91.5
N$11
  Top 0.305: TP31.1 82.5,79 82.5,84.49 SJ7.1 85,86 85.16,85.84 U2.6
N$12
  Top 0.305: U2.5 85.84,90 SJ2.2 TP4.1
N$13  (via drill 0.25)
  Top 0.203: U7.14 83.5,48.25 v83.75,48.5
  Bottom 0.203: v83.75,48.5 R29.2
N$14  (via drill 0.25)
  Top 0.203: U7.15 83.62,47.75 v83.75,47.62
  Bottom 0.203: v83.75,47.62 84.47,47.62 R29.1
N$15
  Top 0.305: U2.4 86.5,91.5 86,92 TP5.1
N$16
  Bottom 0.305: JP3.1 39.99,22.62 U$2.P1_13
N$17
  Top 0.2: J4.2 42.46,81.44 51.57,72.33 55.26,72.33 56,73.06 R19.1
N$18  (via drill 0.25)
  Top 0.203: U7.10 83.56,50.25 v83.75,50.44
  Bottom 0.203: v83.75,50.44 84.49,50.44 R30.2
N$19  (via drill 0.25)
  Top 0.203: U7.11 83.56,49.75 v83.75,49.56
  Bottom 0.203: v83.75,49.56 84.49,49.56 R30.1
N$20
  Top 0.305: U2.7 86.5,84.89 86.48,84.87 86.48,84.48 86,84 C13.1 R4.2 R9.2 85.4,78.1 TP32.1
N$21
  Top 0.305: U1.5 76.84,90 SJ1.2 TP1.1
N$22
  Top 0.305: U1.6 76.16,85.84 76,86 SJ6.1 73.5,84.49 73.5,79 TP29.1
N$23
  Top 0.305: U1.4 77.5,93.5 TP2.1
N$24
  Top 0.305: U1.7 77.5,84.89 77.48,84.87 77.48,84.48 77,84 C12.1 R3.2 R8.2 76.4,78.1 TP30.1
N$25  (via drill 0.25)
  Top 0.2: TP16.1 TP17.1 | U6.1 58.99,85.95 60.04,87 TP16.1 | TP16.1 68,90 66,92 R1.2 | v105.01,92 v105,91.99 U4.3 | v114.01,92 v114,91.99 U5.3 | R20.6 69.54,77.29 v70.25,78
  Bottom 0.2: v114.01,92 v105.01,92 104.01,93 76.54,93 71,87.46 TP17.1 69.75,85.75 69.75,78.5 v70.25,78
N$26
  Top 0.305: U5.5 112.84,90 SJ5.2 | SJ5.2 | TP13.1 SJ5.2
N$27
  Top 0.305: U5.6 112.16,85.84 112,86 SJ10.1 109.5,84.49 109.5,79 TP37.1
N$28
  Top 0.305: U5.4 113.5,93.5 TP14.1
N$29
  Top 0.305: U5.7 113.5,84.89 113.48,84.87 113.48,84.48 113,84 C16.1 R7.2 R12.2 112.4,78.1 TP38.1
N$30
  Bottom 1.75: J11.1 53.25,18.25 42.41,7.41 U$2.P1_1
N$31
  Top 0.305: U4.5 103.84,90 SJ4.2 TP10.1
N$32
  Top 0.305: U4.6 103.16,85.84 103,86 SJ9.1 100.5,84.49 100.5,79 TP35.1
N$33
  Top 0.305: U4.4 104.5,93.5 TP11.1
N$34
  Top 0.2: R28.1 D2.A
N$35
  Top 0.305: U4.7 104.5,84.89 104.48,84.87 104.48,84.48 104,84 C15.1 R6.2 R11.2 103.4,78.1 TP36.1
N$36  (via drill 0.25)
  Top 0.2: U6.2 59.3,85.3 60.56,86.56 66.44,86.56 TP18.1 TP19.1 72.26,83.74 72.26,80.3 71.14,79.17 70.45,79.17 68.94,77.66 68.94,75.56 68.27,74.89 R20.4 | v87,92 U2.3 | v96.01,92 v96,91.99 U3.3
  Bottom 0.2: TP19.1 73,87 73,89 76,92 v87,92 v96.01,92
N$37
  Top 0.305: U3.5 94.84,90 SJ3.2 TP7.1
N$38
  Top 0.305: U3.6 94.16,85.84 94,86 SJ8.1 91.5,84.49 91.5,79 TP33.1
N$39
  Top 0.305: U3.4 95.5,93.5 TP8.1
N$40
  Top 0.305: U3.7 95.5,84.89 95.48,84.87 95.48,84.48 95,84 C14.1 R5.2 R10.2 94.4,78.1 TP34.1
N$44
  Top 0.2: U6.6 54.3,82.7 53.74,83.26 R2.11 R2.12
N$47  (via drill 0.25)
  Top 0.2: U7.34 v88.5,47.75
  Bottom 0.2: TP39.TP 88.06,48 88.31,47.75 v88.5,47.75
N$48  (via drill 0.25)
  Top 0.2: U7.35 88.62,48.25 v88.5,48.38
  Bottom 0.2: TP40.TP 88.12,48.75 v88.5,48.38
N$49  (via drill 0.25)
  Top 0.2: U7.37 88.62,49.25 v88.5,49.12
  Bottom 0.2: TP41.TP 88,49.5 88.38,49.12 v88.5,49.12
N$50  (via drill 0.25)
  Top 0.2: U7.39 88.62,50.25 v88.5,50.38
  Bottom 0.2: TP42.TP 88.38,50.5 v88.5,50.38
N$51  (via drill 0.25)
  Top 0.2: v88.5,51 88.75,51 89,50.75 U7.40
  Bottom 0.2: TP43.TP 88,51.25 88.25,51 v88.5,51
N$52  (via drill 0.25)
  Top 0.152: U7.41 89,51.25
  Top 0.2: 89,51.25 v88.62,51.62
  Bottom 0.2: TP44.TP 87.69,52 88.06,51.62 v88.62,51.62
N$53  (via drill 0.25)
  Top 0.2: U7.43 88.38,52.25 v88.25,52.12
  Bottom 0.152: TP45.TP 87.62,52.75
  Bottom 0.2: 87.62,52.75 v88.25,52.12
N$54  (via drill 0.25)
  Top 0.2: U7.45 88.75,53.25 v88.5,53.5
  Bottom 0.2: TP46.TP v88.5,53.5
N$55
  Top 0.2: U$2.P1_34 38.67,46.81 40.54,46.81 42.5,48.77 42.5,66.15 36.65,72 13,72 9.69,75.31 9.69,78.73 J2.2
N$56  (via drill 0.25)
  other vias: 95.44,27.88 94.5,27 95.44,26.06 96.38,27
  pour Top (no thermals): 99,16.81 99,23.06 96.56,25.5 96.56,27.75 96.06,28.25 94.81,28.25 93.19,26.62 93.19,17 93.38,16.81
N$270
  Top 0.2: R1.1 D1.A
OUT1_N
  Top 0.2: 81.62,51.25 U7.8
  Top 0.381: J9.27 101.38,49.25 101.31,49.18 99.18,49.18 arc-90 96.36,52 96.36,54.65 arc90 93.83,57.19 80.81,57.19 arc90 80.31,56.68 80.31,56.26 arc-90 79.8,55.75 79.4,55.75 arc-90 78.89,56.26 78.89,56.68 arc90 78.39,57.19 77.54,57.19 arc90 75,54.65 75,53.86 arc90 77.54,51.32 78.81,51.32 78.94,51.45 R25.2 80.44,51.45 80.64,51.25 81.62,51.25
OUT1_P
  Top 0.2: 81.62,50.75 U7.9
  Top 0.381: J9.26 101.38,49.75 101.31,49.82 99.18,49.82 arc-90 97,52 97,54.65 arc90 93.83,57.82 77.54,57.82 arc90 74.36,54.65 74.36,53.86 arc90 77.54,50.68 78.81,50.68 78.94,50.55 R25.1 80.44,50.55 80.64,50.75 81.62,50.75
OUT2_N
  Top 0.381: J9.24 99.76,50.75 R24.1
OUT2_P
  Top 0.381: J9.23 100.62,51.25 100.24,51.64 R24.2
OUT3_N
  Top 0.381: J9.21 100.44,52.25 100.26,52.42 R23.1
OUT3_P
  Top 0.381: J9.20 100.88,52.75 100.3,53.33 R23.2
OUT4_N
  Top 0.381: J9.18 100.81,53.75 100.39,54.17 R22.1
OUT4_P
  Top 0.381: J9.17 101.25,54.25 100.42,55.08 R22.2
PRU0  (via drill 0.25)
  Top 0.2: U7.24 84.25,43.25 v85.23,42.27 | J8.2 38.46,52.46 37.43,51.43 U$2.P1_36
  Bottom 0.2: v85.23,42.27 83.5,40.54 76.69,40.54 48.19,69.04 41.06,69.04 38.46,66.44 J8.2
PRU1  (via drill 0.25)
  Top 0.2: U7.26 87.62,43.75 v87.5,43.88 | J8.3 37.92,68 39,68 39.75,67.25 39.75,55.25 42,53 42,50 40.05,48.05 U$2.P1_33
  Bottom 0.2: v87.5,43.88 86.19,43.88 83.18,40.87 76.82,40.87 48.32,69.36 37.37,69.36 35.92,67.92 J8.3
PRU2  (via drill 0.25)
  Top 0.2: U7.27 88.56,44.25 88.31,44.5 v87.5,44.5 | J8.4 31.75,67.62 30.38,67.62 29.62,66.88 29.62,58.62 17.75,46.75 13.27,46.75 U$2.P2_32
  Bottom 0.2: v87.5,44.5 86.35,44.5 83.04,41.19 76.96,41.19 48.46,69.69 35.69,69.69 33.38,67.38 J8.4
PRU3  (via drill 0.25)
  Top 0.2: U7.29 87.62,45.25 v87.5,45.12 | J8.5 30.84,58.84 16.25,44.25 13.31,44.25 U$2.P2_30
  Bottom 0.2: v87.5,45.12 86.51,45.12 82.91,41.52 77.09,41.52 48.59,70.02 33.02,70.02 30.84,67.84 J8.5
PRU4  (via drill 0.25)
  Top 0.2: U7.30 v87.5,45.75 | J8.6 28.3,67.3 29.12,68.12 33.38,68.12 34.62,66.88 34.62,48.38 36.19,46.81 37.98,46.81 39.28,45.51 U$2.P1_31
  Bottom 0.2: v87.5,45.75 86.67,45.75 82.77,41.85 77.23,41.85 48.73,70.35 31.35,70.35 28.3,67.3 J8.6
PRU5  (via drill 0.25)
  Top 0.2: U7.31 87.62,46.25 v87.5,46.38 | J8.7 25.76,56.76 18.31,49.31 13.29,49.31 U$2.P2_34
  Bottom 0.2: v87.5,46.38 86.84,46.38 82.64,42.17 77.36,42.17 48.87,70.67 29.67,70.67 25.76,66.76 J8.7
PRU6  (via drill 0.25)
  Top 0.2: v87.5,47 87.75,47.25 U7.33 | J8.8 23.22,64.22 10,51 10,42.46 U$2.P2_28
  Bottom 0.2: v87.5,47 87,47 82.5,42.5 77.5,42.5 49,71 27,71 23.22,67.22 J8.8
PRU7  (via drill 0.25)
  Top 0.2: v29,53 35,47 35,45.5 36.25,44.25 37.94,44.25 39.22,42.97 U$2.P1_29
  Bottom 0.2: J8.10 18.14,63.86 v29,53
PRU14_OUT
  Top 0.2: J8.11 15.6,57.6 9,51 9,38.38 U$2.P2_24
PRU15_OUT  (via drill 0.25)
  Top 0.2: v8.44,49.5 8.67,49.74 8.67,51.13 13.06,55.52 J8.12
  Bottom 0.2: v8.44,49.5 8.62,49.31 13.31,49.31 U$2.P2_33
PRU16_CLK  (via drill 0.25)
  Top 0.2: U7.23 81.75,43.75 v81,43 | v28,55 28,34.83 32.55,30.27 U$2.P1_20
  Bottom 0.2: v81,43 80.62,43 80.45,42.83 77.64,42.83 49.13,71.33 24.33,71.33 20.68,67.68 J8.9 20.68,62.32 v28,55
PRU_UART_RX  (via drill 0.25)
  Top 0.2: U$2.P1_12 38.69,21.37 38.69,23.25 39.38,23.94 41.94,23.94 43.38,25.38 v43.38,28.5 | v43.38,33.69 43.38,43.26 43.48,43.37 43.48,66.56 37.04,73 27.46,73 J6.2
  Bottom 0.2: v43.38,28.5 v43.38,33.69
PRU_UART_TX  (via drill 0.25)
  Top 0.2: U$2.P1_6 38.69,13.75 38.69,20.5 39.56,21.38 42.38,21.38 44,23 v44,29 | J6.1 29.67,73.33 37.17,73.33 43.81,66.69 43.81,34.51 v44,34.31
  Bottom 0.2: v44,29 v44,34.31
REFCLK
  Top 0.2: R27.2 REFCLK.1 98,36 99.75,37.75 J9.50
REFCLK_ENABLE  (via drill 0.25)
  Top 0.2: v71,51 71,36 72,35 74.38,35 75.22,34.16 X1.1 | v67,70 R20.3 67,74.94 67.62,75.56 67.62,77.62 TP28.1 TP27.1 66.81,82.19 66.81,82.72 64.24,85.3 U6.13
  Bottom 0.2: v71,51 67,55 v67,70
SENSOR_ENABLE  (via drill 0.25)
  Top 0.2: v5,30 5,31.5 5.35,31.85 5.35,87.6 8,90.25 42.75,90.25 J4.1
  Bottom 0.2: U$2.P1_28 29.43,40.43 18,29 6,29 v5,30
SERDES_PWR_DOWN
  Top 0.2: U$2.P2_20 9.73,30.27 6.33,33.67 6.33,84.86 7.31,85.85 14.6,85.85 18.25,89.5 22.75,89.5 26.25,86 31,86 J3.1
SPI1_CLK
  Top 0.2: J9.5 99.21,60.25 93.14,66.33 49.13,66.33 J7.2
  Bottom 0.2: J7.2 34.81,73.35 9.27,73.35 5.65,69.73 5.65,44.35 8.31,41.69 13.29,41.69 U$2.P2_29
SPI1_CS1
  Bottom 0.2: J7.4 35.05,78.67 38.89,78.67 39.69,77.88 39.69,76.58 36.13,73.02 9.41,73.02 5.98,69.59 5.98,47.02 8.75,44.25 13.31,44.25 U$2.P2_31
SPI1_MISO
  Top 0.2: J9.6 99.25,59.75 93,66 46.92,66 J7.3
  Bottom 0.2: J7.3 32.59,73.67 9.13,73.67 5.33,69.86 5.33,42.67 8.81,39.19 13.33,39.19 U$2.P2_27
SPI1_MOSI
  Top 0.2: J9.4 99.17,60.75 93.27,66.65 51.35,66.65 J7.1
  Bottom 0.2: J7.1 41,77.94 39.94,79 33.12,79 32.19,78.06 32.19,76.19 30,74 9,74 5,70 5,40 8.38,36.62 13.3,36.62 U$2.P2_25
TEC+  (via drill 0.25)
  Bottom 5: J13.2 109,8 v109,37
  other vias: 111,35 109,35 107,35 107,37 111,37 109,39 108,38 110,38 108,36 110,36
  pour Top (no thermals): 102,39 104.44,39 106.56,36.88 106.56,34.69 111.5,34.69 111.5,38 108.94,40.56 102,40.56
TEC-  (via drill 0.25)
  other vias: 97.06,27 98,26.06 98.88,27 98,27.94
  pour Top (no thermals): 102.38,42.56 107.94,42.56 108.94,43.56 115.94,43.56 119.5,40 119.5,34.69 112.69,34.69 112.69,37.38 109.06,41 102.38,41
  pour Top (no thermals): 97.38,25.75 98.62,25.75 99.12,26.25 99.12,27.69 100.06,28.62 117.62,28.62 119.5,30.5 119.5,35.38 112.69,35.38 112.69,35.06 111.81,34.19 97.19,34.19 96,33 96,29 96.94,28.06 96.94,26.19
TEC_ENABLE  (via drill 0.25)
  Top 0.2: v53,62 54,63 v60,63 | v65.81,69.38 65.81,73.34 R20.2 | v92,13 93.41,13 Q1.1
  Bottom 0.2: U$2.P1_35 51.38,62 v53,62 54.76,62 91,25.76 91,14 v92,13 | v60,63 65.81,68.81 v65.81,69.38
TEC_GND  (via drill 0.25)
  Top 5: J13.1 98.28,5.72 Q1.3 99.63,12.69 103.44,16.5 103.44,23.62
  other vias: 99.62,27 100.5,26.06 101.44,27 100.5,27.94
  pour Top (no thermals): 99.5,27.5 99.5,23.88 102.25,21.12 105.88,21.12 105.88,26.12 103.75,28.25 100.25,28.25
THERM+
  Top 0.305: J9.9 98.75,58.25 95,62 THERM+.1 C18.1 R21.1 83.9,64.79 83.41,65.28 77,65.28 41.99,30.27 U$2.P1_19
THERM-
  Top 0.305: JP1.2 THERM-.1 94,64 99.25,58.75 J9.8
TXCLK_N
  Top 0.2: 81.62,47.25 U7.16
  Top 0.381: J9.30 101.38,47.75 101.31,47.68 99.54,47.68 arc90 97,45.14 97,43 arc-90 93.86,39.86 77.54,39.86 arc-90 74.36,43.04 74.36,44.15 arc-90 77.54,47.32 79.32,47.32 79.45,47.45 R26.1 80.44,47.45 80.64,47.25 81.62,47.25
TXCLK_P
  Top 0.2: 81.62,46.75 U7.17
  Top 0.381: J9.29 101.38,48.25 101.31,48.32 99.54,48.32 arc90 96.36,45.14 96.36,43 arc-90 93.86,40.5 80.81,40.5 arc-90 80.31,41 80.31,41.42 arc90 79.8,41.93 79.47,41.93 arc90 78.97,41.42 78.97,41 arc-90 78.46,40.5 77.54,40.5 arc-90 75,43.04 75,44.15 arc-90 77.54,46.69 79.38,46.69 79.51,46.55 R26.2 80.44,46.55 80.64,46.75 81.62,46.75
UART0_RX
  Top 0.2: U$2.P1_32 38.69,44.25 40.61,44.25 42.83,46.47 42.83,66.29 36.79,72.33 13.67,72.33 10.92,75.08 J5.3
UART0_TX
  Top 0.2: U$2.P1_30 37.99,42.97 39.27,41.69 40.59,41.69 43.15,44.25 43.15,66.42 36.92,72.65 15.35,72.65 13.46,74.54 J5.2
USB_N
  Top 0.2: U$2.P1_9 41.08,18.68 54.38,18.68 arc-90 54.63,18.42 arc90 54.89,18.16 55.59,18.16 arc90 55.85,18.42 arc-90 56.11,18.68 57.32,18.68 58.81,17.19 58.81,16.94 58,16.12 J12.D-
USB_P
  Top 0.2: U$2.P1_11 41.08,19 57.46,19 59.14,17.32 59.14,16.94 60,16.08 J12.D+
VDD  (via drill 0.25)
  Top 0.152: v44.38,12.5 44.5,12.5 47.16,9.84
  Top 1.75: U$2.P2_13 17.35,22.65 36,4 41.31,4 47.16,9.84 51.52,14.21 J12.VBUS
  Bottom 0.2: JP2.2 v44.38,12.5
  Bottom 1.75: U$2.P2_13 20.65,22.65 33.35,35.35 U$2.P1_24
VDETCOM
  pour Top (isolate 0.254, no thermals): 81.04,75 75.25,75 75.25,86.44 81.04,86.44
VDETCOM-2.9V
  Top 0.2: R13.1 80.25,76.06
  Top 1.27: 104.19,57 106,57 107.75,58.75 107.75,66.19 103.62,70.31 84.6,70.31 80.25,74.66 80.25,76.06
  pour Top (no thermals): 102.31,57.5 104.5,57.5 104.5,56.5 102.31,56.5
VPH
  pour Top (isolate 0.254, no thermals): 108.04,75 102.25,75 102.25,86.44 108.04,86.44
VPH-3.3V
  Top 0.254: 107.25,76 R16.1
  Top 1.27: 104.31,45 106.38,45 113.19,51.81 113.19,68.38 107.25,74.31 107.25,76
  pour Top (no thermals): 102.31,45.5 104.5,45.5 104.5,44.5 102.31,44.5
VPL
  pour Top (isolate 0.254, no thermals): 99.04,75 93.25,75 93.25,86.44 99.04,86.44
VPL-1.6V
  Top 0.254: 98.25,75.94 R15.1
  Top 1.27: 104.25,46.5 105.25,46.5 111.38,52.62 111.38,67.62 104.94,74.06 99.44,74.06 98.25,75.25 98.25,75.94
  pour Top (no thermals): 102.31,47 104.5,47 104.5,46 102.31,46
VPOS
  pour Top (isolate 0.254, no thermals): 117.04,75 111.25,75 111.25,86.44 117.04,86.44
VPOS-3.3V
  Top 0.254: 116.25,75.88 R17.1
  Top 1.27: 104.31,43.5 107.5,43.5 115,51 115,68.25 116.25,69.5 116.25,75.88
  pour Top (no thermals): 102.31,44 104.5,44 104.5,43 102.31,43
VPOUT
  pour Top (isolate 0.254, no thermals): 90.04,75 84.25,75 84.25,86.44 90.04,86.44
VPOUT-0.9V
  Top 0.254: 89.25,75.94 R14.1
  Top 1.27: 104.19,55.5 107,55.5 109.56,58.06 109.56,66.94 104.25,72.25 91.12,72.25 89.25,74.12 89.25,75.94
  pour Top (no thermals): 102.31,56 104.5,56 104.5,55 102.31,55

## Text on the board
tPlace: SERDES ENABLE | SENSOR ENABLE | OreSat PIRT1280A1-12 Carrier Board v1.0 | JAMSYNC | GPIO | GPIO | PIRT1280 ENABLE | 2021-04-12 | OLIVER REW | GPIO | ENABLE | ENABLE | CAN0 | OFF | DISABLE | DISABLE | UART0 | PRU UART | SPI | GND | RX | TX | 3.3V | GND | RX | TX | GND | CS | MISO | CLK | MOSI | CAMERA/PRU | GND | R30_15 | R30_14 | R30_7 | CLK | D6 | D5 | D4 | D3 | D2 | D1 | D0 | GND | TEC | POCKETBEAGLE / POWER | 5V MAX / 2A | MANUAL | GPIO | 5V | GND | 8.2VDC @ 27C / 9.2VDC @ 50C / 2.5A | - | +
Document: TODOimage sensor test board with test points and load resistors
tDocu: copper plate thickness = 9.5mm / ribbon cable length = 30mm / / 9.5mm^2 + x^2 = 30mm^2 / x = ~28.4mm / / **Distance between connectors should / be less than 28mm, lets say 20mm?***